# Altium project MQP_DC_AC_Inverter.PrjPcb (part 3 of 4)
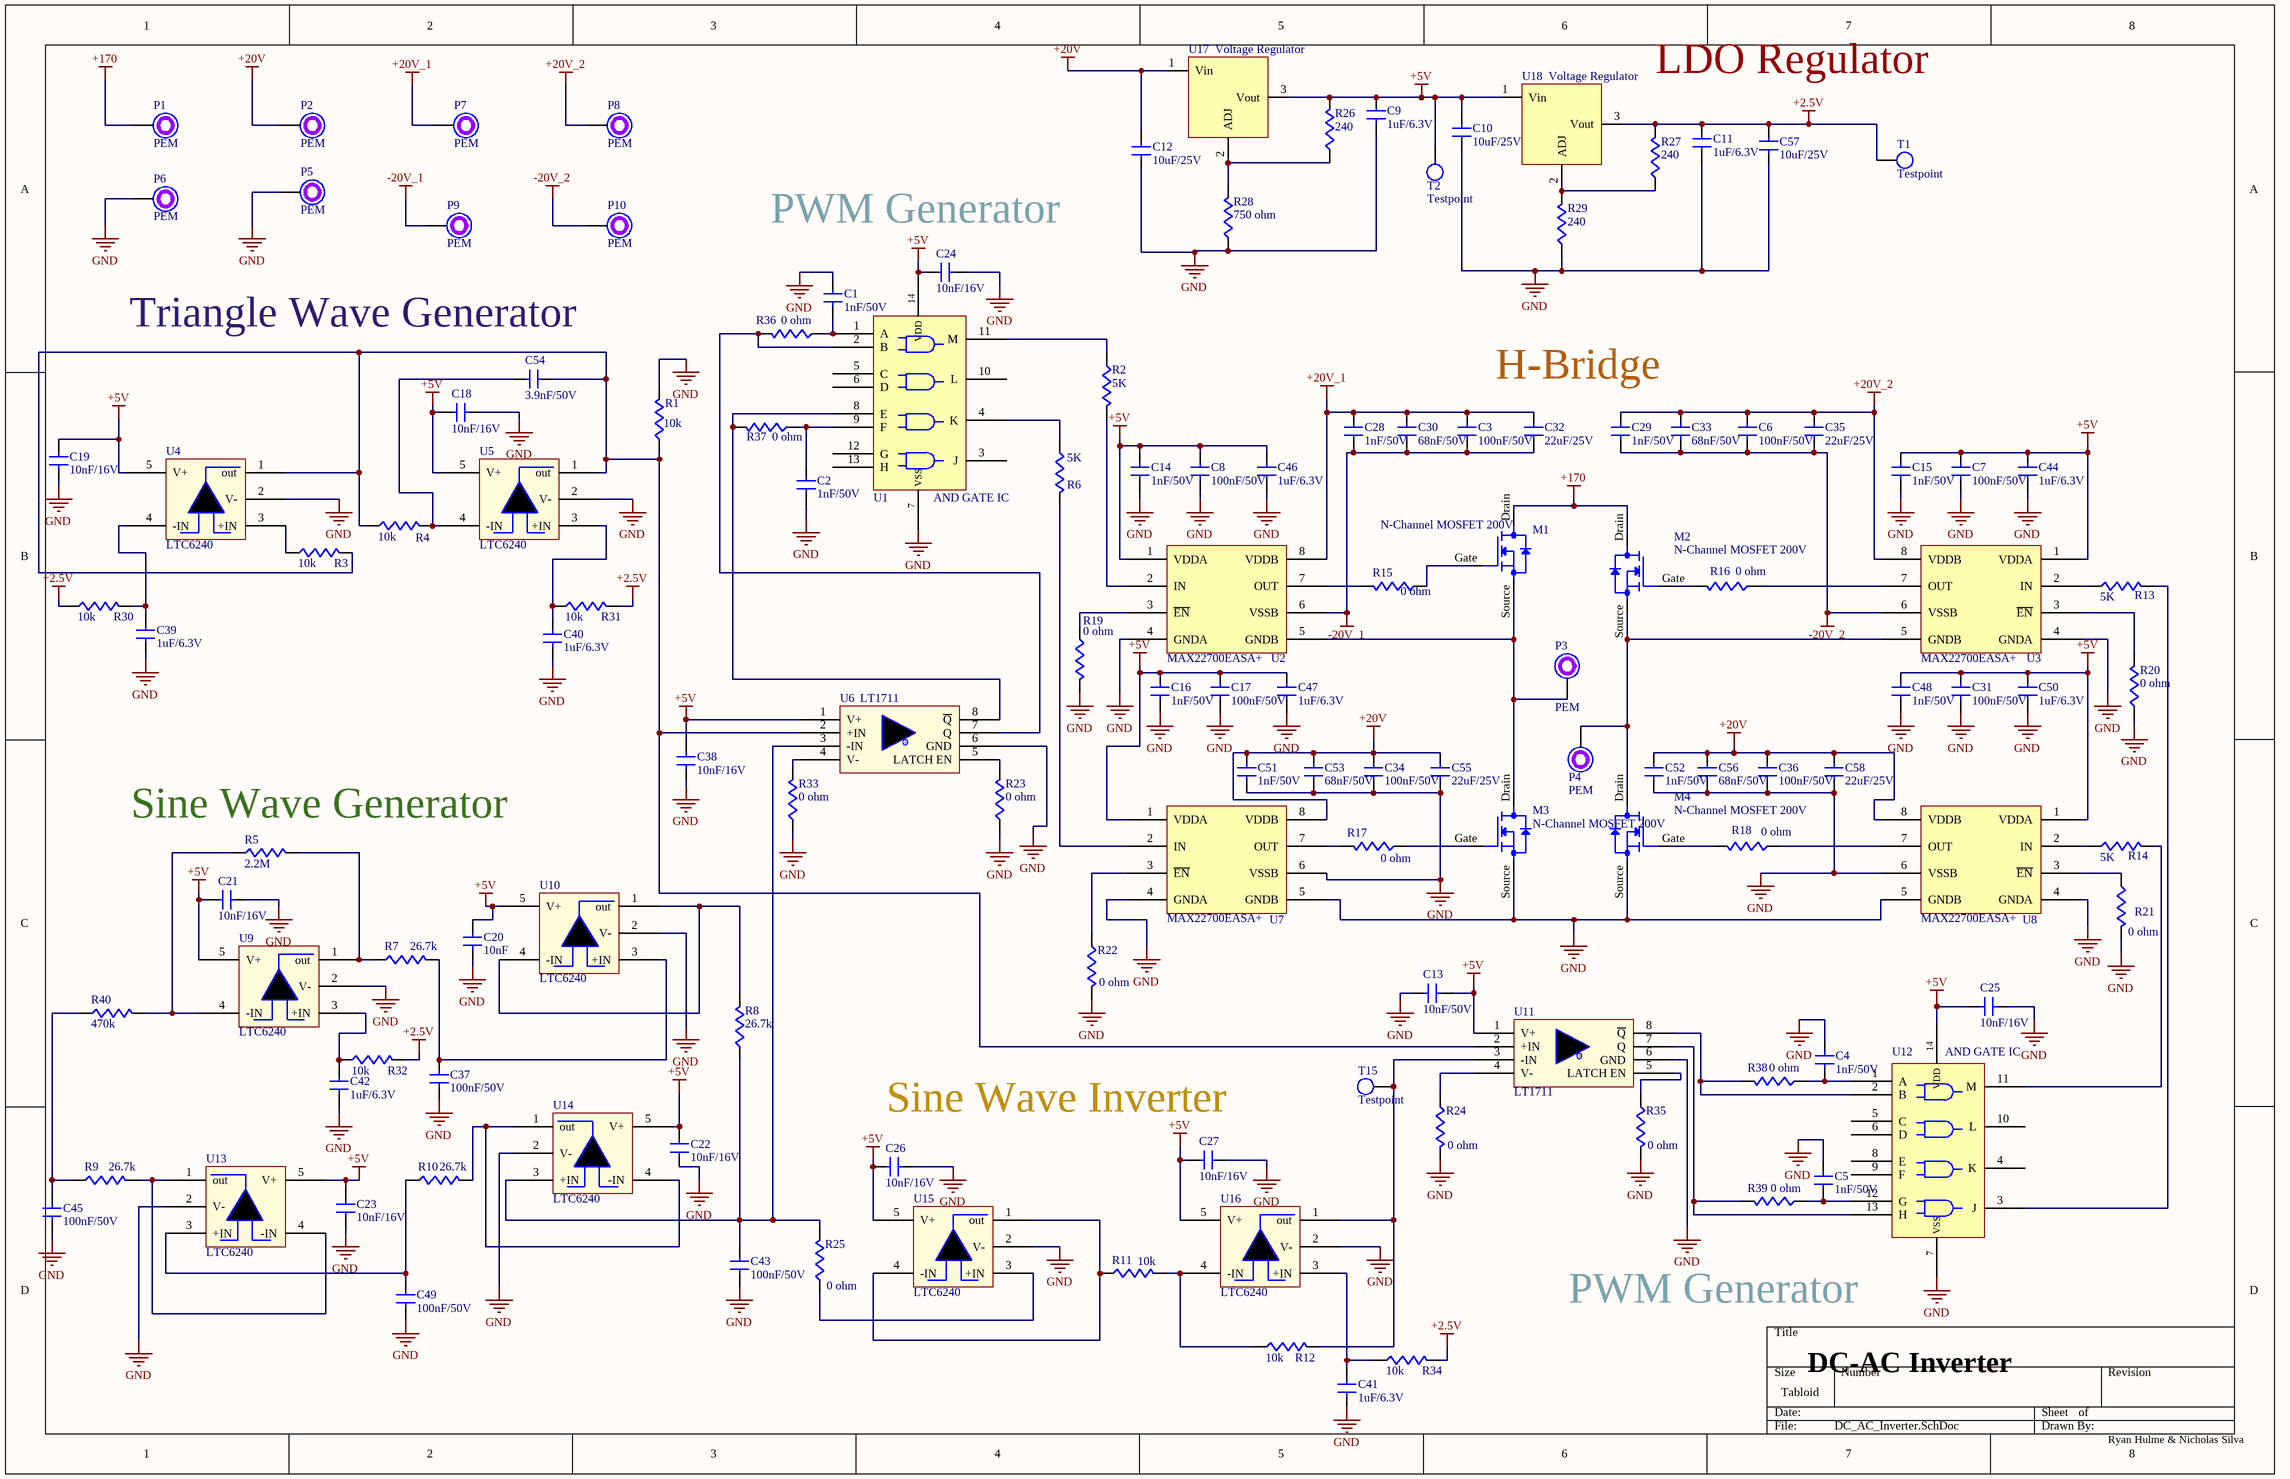
[diagram p2: DC_AC_Inverter.SchDoc]

## Sheet DC_AC_Inverter.SchDoc (continued)

### Library data of the parts (continued)
C30 C33 C53 C56 = C0603C683K5RACTU: Ceramic Capacitor, Multilayer, Ceramic, 50V, 10% +Tol, 10% -Tol, X7R, 15% TC, 0.068uF, Surface Mount, 0603; Manufacturer: KEMET; Value: 68nF; Dissipation Factor: 2.5%; Temperature Coefficient: 30ppm/°C; Supplier: DigiKey; Supplier Part Number: 399-C0603C683K5RACTUCT-ND; Manufacturer Part Number: C0603C683K5RACTU; RoHS: Compliant; Category: Ceramic Capacitors; Stock: 75691; Pricing: 1=0.1, 10=0.054, 50=0.0374, 100=0.0323, 500=0.0237, 1000=0.02004 (USD); Case/Package: 0603; Case Code (Imperial): 0603; Case Code (Metric): 1608; China RoHS: Compliant; Country of Origin: Mexico; Depth: 800µm; Dielectric: X7R; Dielectric Material: Ceramic; Export Control Classification Number (ECCN) Code: EAR99; Height: 800µm; Harmonized Tariff Schedule (HTS) Code: 8532.24.00.20; Introduction Date: 2008-01-10; Lead Pitch: 700µm; Length: 1.6mm; Lifecycle Status: Production; Material: Ceramic; Max Operating Temperature: 125°C; Min Operating Temperature: -55°C; Mounting Technology: Surface Mount; Pins: 2; Number of Terminals: 2; Packaging: Cut Tape; Radiation Hardening: No; REACH SVHC: Yes; Schedule B: 8532240020, 8532240020|8532240020, 8532240020|8532240020|8532240020, 8532240020|8532240020|8532240020|8532240020; Termination: SMD/SMT; Thickness: 863.6µm; Tolerance: 10%; Voltage: 50V; Voltage Rating: 50V; Voltage Rating (AC): 50V; Voltage Rating (DC): 50V; Width: 800µm; ComponentLink1URL: https://datasheet.octopart.com:443/C0603C683K5RACTU-KEMET-datasheet-178445679.pdf?src-supplier=IHS; ComponentLink1Description: https://datasheet.octopart.com:443/C0603C683K5RACTU-KEMET-datasheet-178445679.pdf?src-supplier=IHS; ComponentLink2URL: https://datasheet.octopart.com:443/C0603C683K5RAC7867-KEMET-datasheet-184792974.pdf?src-supplier=IHS; ComponentLink2Description: https://datasheet.octopart.com:443/C0603C683K5RAC7867-KEMET-datasheet-184792974.pdf?src-supplier=IHS; ComponentLink3URL: https://datasheet.octopart.com:443/C0603C683K5RACTU-KEMET-datasheet-137357759.pdf?src-supplier=Farnell; ComponentLink3Description: https://datasheet.octopart.com:443/C0603C683K5RACTU-KEMET-datasheet-137357759.pdf?src-supplier=Farnell; ComponentLink4URL: https://datasheet.octopart.com:443/C0603C683K5RACTU-KEMET-datasheet-101575963.pdf?src-supplier=Farnell; ComponentLink4Description: https://datasheet.octopart.com:443/C0603C683K5RACTU-KEMET-datasheet-101575963.pdf?src-supplier=Farnell; ComponentLink5URL: https://datasheet.octopart.com:443/C0603C683K5RACTU-KEMET-datasheet-176142257.pdf?src-supplier=Farnell; ComponentLink5Description: https://datasheet.octopart.com:443/C0603C683K5RACTU-KEMET-datasheet-176142257.pdf?src-supplier=Farnell; ComponentLink6URL: https://datasheet.octopart.com:443/C0603C683K5RACTU-Kemet-datasheet-500041.pdf?src-supplier=Farnell; ComponentLink6Description: https://datasheet.octopart.com:443/C0603C683K5RACTU-Kemet-datasheet-500041.pdf?src-supplier=Farnell; ComponentLink7URL: https://datasheet.octopart.com:443/C0603C683K5RACTU-KEMET-datasheet-137357764.pdf?src-supplier=Upverter; ComponentLink7Description: https://datasheet.octopart.com:443/C0603C683K5RACTU-KEMET-datasheet-137357764.pdf?src-supplier=Upverter; ComponentLink8URL: https://datasheet.octopart.com:443/C0603C683K5RACTU-KEMET-datasheet-157246124.pdf?src-supplier=Electro+Sonic; ComponentLink8Description: https://datasheet.octopart.com:443/C0603C683K5RACTU-KEMET-datasheet-157246124.pdf?src-supplier=Electro+Sonic; ComponentLink9URL: https://datasheet.octopart.com:443/C0603C683K5RACTU-KEMET-datasheet-32036385.pdf?src-supplier=Electro+Sonic; ComponentLink9Description: https://datasheet.octopart.com:443/C0603C683K5RACTU-KEMET-datasheet-32036385.pdf?src-supplier=Electro+Sonic; ComponentLink10URL: https://datasheet.octopart.com:443/C0603C683K5RACTU-KEMET-datasheet-178088105.pdf?src-supplier=Newark; ComponentLink10Description: https://datasheet.octopart.com:443/C0603C683K5RACTU-KEMET-datasheet-178088105.pdf?src-supplier=Newark; ComponentLink11URL: https://datasheet.octopart.com:443/C0603C683K5RACTU-KEMET-datasheet-130256537.pdf?src-supplier=Newark; ComponentLink11Description: https://datasheet.octopart.com:443/C0603C683K5RACTU-KEMET-datasheet-130256537.pdf?src-supplier=Newark; ComponentLink12URL: https://datasheet.octopart.com:443/C0603C683K5RACTU-Kemet-datasheet-27203261.pdf?src-supplier=Newark; ComponentLink12Description: https://datasheet.octopart.com:443/C0603C683K5RACTU-Kemet-datasheet-27203261.pdf?src-supplier=Newark; ComponentLink13URL: https://datasheet.octopart.com:443/C0603C683K5RACTU-Kemet-datasheet-12608295.pdf?src-supplier=Newark; ComponentLink13Description: https://datasheet.octopart.com:443/C0603C683K5RACTU-Kemet-datasheet-12608295.pdf?src-supplier=Newark; ComponentLink14URL: https://datasheet.octopart.com:443/C0603C683K5RACTU-Kemet-datasheet-11992184.pdf?src-supplier=Newark; ComponentLink14Description: https://datasheet.octopart.com:443/C0603C683K5RACTU-Kemet-datasheet-11992184.pdf?src-supplier=Newark; ComponentLink15URL: https://datasheet.octopart.com:443/C0603C683K5RACTU-Kemet-datasheet-10942409.pdf?src-supplier=Newark; ComponentLink15Description: https://datasheet.octopart.com:443/C0603C683K5RACTU-Kemet-datasheet-10942409.pdf?src-supplier=Newark; ComponentLink16URL: https://datasheet.octopart.com:443/C0603C683K5RACTU-Kemet-datasheet-10404442.pdf?src-supplier=Newark; ComponentLink16Description: https://datasheet.octopart.com:443/C0603C683K5RACTU-Kemet-datasheet-10404442.pdf?src-supplier=Newark; ComponentLink17URL: https://datasheet.octopart.com:443/C0603C683K5RACTU-KEMET-datasheet-164512540.pdf?src-supplier=TME; ComponentLink17Description: https://datasheet.octopart.com:443/C0603C683K5RACTU-KEMET-datasheet-164512540.pdf?src-supplier=TME; ComponentLink18URL: https://datasheet.octopart.com:443/C0603C683K5RACTU-KEMET-datasheet-68304558.pdf?src-supplier=TME; ComponentLink18Description: https://datasheet.octopart.com:443/C0603C683K5RACTU-KEMET-datasheet-68304558.pdf?src-supplier=TME; ComponentLink19URL: https://datasheet.octopart.com:443/C0603C683K5RACTU-KEMET-datasheet-68331906.pdf?src-supplier=TME; ComponentLink19Description: https://datasheet.octopart.com:443/C0603C683K5RACTU-KEMET-datasheet-68331906.pdf?src-supplier=TME; ComponentLink20URL: https://datasheet.octopart.com:443/C0603C683K5RACTU-KEMET-datasheet-110724412.pdf?src-supplier=RS+(Formerly+Allied+Electronics); ComponentLink20Description: https://datasheet.octopart.com:443/C0603C683K5RACTU-KEMET-datasheet-110724412.pdf?src-supplier=RS+(Formerly+Allied+Electronics); ComponentLink21URL: https://datasheet.octopart.com:443/C0603C683K5RACTU-Kemet-datasheet-60243841.pdf?src-supplier=RS+(Formerly+Allied+Electronics); ComponentLink21Description: https://datasheet.octopart.com:443/C0603C683K5RACTU-Kemet-datasheet-60243841.pdf?src-supplier=RS+(Formerly+Allied+Electronics); ComponentLink22URL: https://datasheet.octopart.com/C0603C683K5RACTU-KEMET-datasheet-84169754.pdf; ComponentLink22Description: https://datasheet.octopart.com/C0603C683K5RACTU-KEMET-datasheet-84169754.pdf; ComponentLink23URL: https://datasheet.octopart.com:443/C0603C683K5RACTU-Kemet-datasheet-24570007.pdf?src-supplier=element14+APAC; ComponentLink23Description: https://datasheet.octopart.com:443/C0603C683K5RACTU-Kemet-datasheet-24570007.pdf?src-supplier=element14+APAC; ComponentLink24URL: https://datasheet.octopart.com:443/C0603C683K5RACTU-Kemet-datasheet-22084244.pdf?src-supplier=element14+APAC; ComponentLink24Description: https://datasheet.octopart.com:443/C0603C683K5RACTU-Kemet-datasheet-22084244.pdf?src-supplier=element14+APAC; ComponentLink25URL: https://datasheet.octopart.com:443/C0603C683K5RACTU-Kemet-datasheet-11790453.pdf?src-supplier=Arrow+Electronics; ComponentLink25Description: https://datasheet.octopart.com:443/C0603C683K5RACTU-Kemet-datasheet-11790453.pdf?src-supplier=Arrow+Electronics; ComponentLink26URL: https://datasheet.octopart.com:443/C0603C683K5RAC7867-KEMET-datasheet-164857143.pdf?src-supplier=Burklin+Elektronik; ComponentLink26Description: https://datasheet.octopart.com:443/C0603C683K5RAC7867-KEMET-datasheet-164857143.pdf?src-supplier=Burklin+Elektronik
C32 C35 C55 C58 = GRM188C61E226ME01J: Ceramic Capacitor, Multilayer, Ceramic, 25V, 20% +Tol, 20% -Tol, X5S, 22% TC, 22uF, Surface Mount, 0603; Manufacturer: Murata; Value: 22µF; Supplier: DigiKey; Supplier Part Number: 490-GRM188C61E226ME01JDKR-ND; Manufacturer Part Number: GRM188C61E226ME01J; RoHS: Compliant; Category: Ceramic Capacitors; Stock: 20437; Pricing: 1=0.41, 10=0.244, 50=0.181, 100=0.1615, 500=0.12866, 1000=0.11854, 2500=0.10786, 5000=0.10143 (USD); Case/Package: 0603; Dielectric: X5S; Dielectric Material: Ceramic; Export Control Classification Number (ECCN) Code: EAR99; Height: 800µm; Harmonized Tariff Schedule (HTS) Code: 8532.24.00.20; Introduction Date: 2024-04-22; Length: 1.6mm; Lifecycle Status: Production; Material: Ceramic; Max Operating Temperature: 85°C; Min Operating Temperature: -55°C; Mounting Technology: Surface Mount; Number of Terminals: 2; REACH SVHC: Yes; Thickness: 800µm; Tolerance: 20%; Voltage Rating: 25V; Voltage Rating (DC): 25V; Width: 800µm; ComponentLink1URL: https://datasheet.octopart.com/GRM188C61E226ME01J-Murata-datasheet-12515295.pdf; ComponentLink1Description: https://datasheet.octopart.com/GRM188C61E226ME01J-Murata-datasheet-12515295.pdf; ComponentLink2URL: https://datasheet.octopart.com/GRM188C61E226ME01J-Murata-datasheet-12510076.pdf; ComponentLink2Description: https://datasheet.octopart.com/GRM188C61E226ME01J-Murata-datasheet-12510076.pdf; ComponentLink3URL: https://datasheet.octopart.com/GRM188C61E226ME01J-Murata-datasheet-11978611.pdf; ComponentLink3Description: https://datasheet.octopart.com/GRM188C61E226ME01J-Murata-datasheet-11978611.pdf; ComponentLink4URL: https://datasheet.octopart.com/GRM188C61E226ME01J-Murata-datasheet-10025737.pdf; ComponentLink4Description: https://datasheet.octopart.com/GRM188C61E226ME01J-Murata-datasheet-10025737.pdf; ComponentLink5URL: https://datasheet.octopart.com/GRM188C61E226ME01J-Murata-datasheet-8819587.pdf; ComponentLink5Description: https://datasheet.octopart.com/GRM188C61E226ME01J-Murata-datasheet-8819587.pdf; ComponentLink6URL: http://sigma.octopart.com:80/reach_statement/Murata-company-16.pdf?src-supplier=Compliance+Statements; ComponentLink6Description: http://sigma.octopart.com:80/reach_statement/Murata-company-16.pdf?src-supplier=Compliance+Statements
C54 = GCM1885C1H392JA16D: 0603 3.9 nF 50 V ±5 % Tolerance C0G SMT Multilayer Ceramic Capacitor; Manufacturer: Murata; Manufacturer Lifecycle Status: IN PRODUCTION; Value: 3.9nF; Temperature Coefficient: 30ppm/°C; Tolerance: 5%; Voltage Rating: 50V; Supplier: DigiKey; Supplier Part Number: 490-11958-1-ND; Manufacturer Part Number: GCM1885C1H392JA16D; RoHS: Compliant; Category: Ceramic Capacitors; Stock: 87384; Pricing: 1=0.1, 10=0.046, 50=0.0314, 100=0.027, 500=0.01964, 1000=0.01737 (USD); Case/Package: 0603; Case Code (Imperial): 0603; Case Code (Metric): 1608; Depth: 800µm; Dielectric: C0G; Dielectric Material: Ceramic; Export Control Classification Number (ECCN) Code: EAR99; Height: 800µm; Harmonized Tariff Schedule (HTS) Code: 8532.24.00.20; Introduction Date: 2010-10-29; Lead Free: Lead Free; Length: 1.6mm; Lifecycle Status: Production; Material: Ceramic; Max Operating Temperature: 125°C; Min Operating Temperature: -55°C; Mounting Technology: Surface Mount; Number of Terminals: 2; Packaging: Tape and Reel; Ratings: AEC-Q200; REACH SVHC: Yes; Schedule B: 8532240020, 8532240020|8532240020, 8532240020|8532240020|8532240020, 8532240020|8532240020|8532240020|8532240020; Termination: SMD/SMT; Voltage Rating (DC): 50V; Weight: 6.293594mg; Width: 800µm; ComponentLink1URL: https://datasheet.octopart.com:443/GCM1885C1H392JA16D-Murata-datasheet-149522577.pdf?src-supplier=Newark; ComponentLink1Description: https://datasheet.octopart.com:443/GCM1885C1H392JA16D-Murata-datasheet-149522577.pdf?src-supplier=Newark; ComponentLink2URL: https://datasheet.octopart.com:443/GCM1885C1H392JA16D-Murata-datasheet-141266224.pdf?src-supplier=Ciiva; ComponentLink2Description: https://datasheet.octopart.com:443/GCM1885C1H392JA16D-Murata-datasheet-141266224.pdf?src-supplier=Ciiva; ComponentLink3URL: https://datasheet.octopart.com:443/GCM1885C1H392JA16D-Murata-datasheet-140657019.pdf?src-supplier=Ciiva; ComponentLink3Description: https://datasheet.octopart.com:443/GCM1885C1H392JA16D-Murata-datasheet-140657019.pdf?src-supplier=Ciiva; ComponentLink4URL: https://datasheet.octopart.com:443/GCM1885C1H392JA16D-Murata-datasheet-138716719.pdf?src-supplier=Ciiva; ComponentLink4Description: https://datasheet.octopart.com:443/GCM1885C1H392JA16D-Murata-datasheet-138716719.pdf?src-supplier=Ciiva; ComponentLink5URL: https://datasheet.octopart.com:443/GCM1885C1H392JA16D-Murata-datasheet-142295892.pdf?src-supplier=Arrow.cn; ComponentLink5Description: https://datasheet.octopart.com:443/GCM1885C1H392JA16D-Murata-datasheet-142295892.pdf?src-supplier=Arrow.cn; ComponentLink6URL: https://datasheet.octopart.com:443/GCM1885C1H392JA16D-Murata-datasheet-12532847.pdf?src-supplier=Future+Electronics; ComponentLink6Description: https://datasheet.octopart.com:443/GCM1885C1H392JA16D-Murata-datasheet-12532847.pdf?src-supplier=Future+Electronics; ComponentLink7URL: https://datasheet.octopart.com:443/GCM1885C1H392JA16D-Murata-datasheet-44781017.pdf?src-supplier=Future+Electronics; ComponentLink7Description: https://datasheet.octopart.com:443/GCM1885C1H392JA16D-Murata-datasheet-44781017.pdf?src-supplier=Future+Electronics; ComponentLink8URL: https://datasheet.octopart.com:443/GCM1885C1H392JA16D-Murata-datasheet-12511495.pdf?src-supplier=TME; ComponentLink8Description: https://datasheet.octopart.com:443/GCM1885C1H392JA16D-Murata-datasheet-12511495.pdf?src-supplier=TME; ComponentLink9URL: http://sigma.octopart.com:80/reach_statement/Murata-company-16.pdf?src-supplier=Compliance+Statements; ComponentLink9Description: http://sigma.octopart.com:80/reach_statement/Murata-company-16.pdf?src-supplier=Compliance+Statements
M1-M4 = IPB068N20NM6ATMA1: Trans MOSFET N-CH 200V 15.4A 3-Pin(2+Tab) D2PAK T/R; Manufacturer: Infineon; Supplier: DigiKey; Supplier Part Number: 448-IPB068N20NM6ATMA1CT-ND; Manufacturer Part Number: IPB068N20NM6ATMA1; RoHS: Compliant; Category: MOSFETs; Stock: 4020; Pricing: 1=8.02, 10=5.45, 100=4.2066 (USD); Lifecycle Status: Production; REACH SVHC: Yes; ComponentLink1URL: https://datasheet.octopart.com:443/IPB068N20NM6ATMA1-Infineon-datasheet-188885164.pdf?src-supplier=TME; ComponentLink1Description: https://datasheet.octopart.com:443/IPB068N20NM6ATMA1-Infineon-datasheet-188885164.pdf?src-supplier=TME; ComponentLink2URL: http://sigma.octopart.com:80/conflict_mineral_statement/Infineon-company-51.pdf?src-supplier=Compliance+Statements; ComponentLink2Description: http://sigma.octopart.com:80/conflict_mineral_statement/Infineon-company-51.pdf?src-supplier=Compliance+Statements
P1-P10 = PEMs: PEM: / SMTSOB-632-4ET
R1 R3 R4 R11 R12 R30-R32 R34 = Y116910K0000T9R: Res Metal Foil 2917 10K Ohm 0.01% 3/5W 2ppm/C Molded SMD T/R - Custom Tape W/Lea; Manufacturer: VPG Foil Resistors; Power Dissipation: 300mW; Power Rating: 600mW; Value: 10kΩ; Rise Time: 1ns; Temperature Coefficient: 2ppm/°C; Voltage Rating: 300V; Working Voltage: 180V; Supplier: DigiKey; Supplier Part Number: Y1169-10KCT-ND; Manufacturer Part Number: Y116910K0000T9R; RoHS: Compliant; Category: Chip SMD Resistors; Stock: 296; Pricing: 1=30.94, 10=22.172, 25=19.8044, 50=18.3232 (USD); Case/Package: Molded; China RoHS: Compliant; Composition: Metal Foil; Depth: 4.32mm; Height: 2.79mm; Length: 7.29mm; Lifecycle Status: Production; Max Operating Temperature: 175°C; Military Standard: MIL-PRF-55182; Min Operating Temperature: -55°C; Mounting Technology: Surface Mount; Number of Terminals: 2; REACH SVHC: Yes; Termination: J-Lead; Tolerance: 0.01%; Voltage Rating (AC): 300V; Voltage Rating (DC): 300V; Width: 4.32mm; ComponentLink1URL: https://datasheet.octopart.com:443/Y116910K0000T9R-VPG-Foil-Resistors-datasheet-41195406.pdf?src-supplier=IHS; ComponentLink1Description: https://datasheet.octopart.com:443/Y116910K0000T9R-VPG-Foil-Resistors-datasheet-41195406.pdf?src-supplier=IHS; ComponentLink2URL: https://datasheet.octopart.com:443/Y116910K0000T9R-VPG-Foil-Resistors-datasheet-182187878.pdf?src-supplier=IHS; ComponentLink2Description: https://datasheet.octopart.com:443/Y116910K0000T9R-VPG-Foil-Resistors-datasheet-182187878.pdf?src-supplier=IHS; ComponentLink3URL: https://datasheet.octopart.com:443/Y116910K0000T9R-VPG-Foil-Resistors-datasheet-12518376.pdf?src-supplier=Factory+Futures; ComponentLink3Description: https://datasheet.octopart.com:443/Y116910K0000T9R-VPG-Foil-Resistors-datasheet-12518376.pdf?src-supplier=Factory+Futures
R2 R6 R13 R14 = PNM0805E5001BST5: Res Thin Film 0805 5K Ohm 0.1% 0.2W(1/5W) ±25ppm/C Sulfur Resistant Pad SMD Medical T/R; Manufacturer: Vishay; Power Dissipation: 200mW; Value: 5kΩ; Temperature Coefficient: 25ppm/°C; Voltage Rating: 100V; Supplier: DigiKey; Supplier Part Number: PNM0805-5.0KBCT-ND; Manufacturer Part Number: PNM0805E5001BST5; RoHS: Compliant; Category: Chip SMD Resistors; Stock: 3988; Pricing: 1=0.78, 10=0.647, 25=0.5996, 50=0.5668, 100=0.5274, 250=0.50048 (USD); Case/Package: 0805; Case Code (Imperial): 0805; Case Code (Metric): 2012; Composition: Thin Film; Height: 381µm; Length: 2.032mm; Lifecycle Status: Production; Max Operating Temperature: 150°C; Min Operating Temperature: -55°C; Mounting Technology: Surface Mount; Pins: 2; Number of Terminals: 2; Packaging: Cut Tape; Power Rating: 200mW; Radiation Hardening: No; REACH SVHC: Yes; Schedule B: 8533210045, 8533210045|8533210045|8533210045|8533210045|8533210045; Tolerance: 0.1%; Voltage Rating (DC): 100V; Width: 1.27mm; Working Voltage: 100V; ComponentLink1URL: https://datasheet.octopart.com:443/PNM0805E5001BST5-Vishay-datasheet-170667721.pdf?src-supplier=IHS; ComponentLink1Description: https://datasheet.octopart.com:443/PNM0805E5001BST5-Vishay-datasheet-170667721.pdf?src-supplier=IHS; ComponentLink2URL: https://datasheet.octopart.com:443/PNM0805E5001BST5-Vishay-datasheet-12549948.pdf?src-supplier=Factory+Futures; ComponentLink2Description: https://datasheet.octopart.com:443/PNM0805E5001BST5-Vishay-datasheet-12549948.pdf?src-supplier=Factory+Futures; ComponentLink3URL: https://datasheet.octopart.com:443/PNM0805E5001BST5-Vishay-datasheet-12534889.pdf?src-supplier=Factory+Futures; ComponentLink3Description: https://datasheet.octopart.com:443/PNM0805E5001BST5-Vishay-datasheet-12534889.pdf?src-supplier=Factory+Futures; ComponentLink4URL: https://datasheet.octopart.com:443/PNM0805E5001BST5-Vishay-datasheet-12521829.pdf?src-supplier=Factory+Futures; ComponentLink4Description: https://datasheet.octopart.com:443/PNM0805E5001BST5-Vishay-datasheet-12521829.pdf?src-supplier=Factory+Futures; ComponentLink5URL: https://datasheet.octopart.com:443/PNM0805E5001BST5-Vishay-datasheet-12520543.pdf?src-supplier=Factory+Futures; ComponentLink5Description: https://datasheet.octopart.com:443/PNM0805E5001BST5-Vishay-datasheet-12520543.pdf?src-supplier=Factory+Futures; ComponentLink6URL: https://datasheet.octopart.com:443/PNM0805E5001BST5-Vishay-datasheet-62321198.pdf?src-supplier=Farnell; ComponentLink6Description: https://datasheet.octopart.com:443/PNM0805E5001BST5-Vishay-datasheet-62321198.pdf?src-supplier=Farnell; ComponentLink7URL: https://datasheet.octopart.com:443/PNM0805E5001BST5-Vishay-datasheet-10025851.pdf?src-supplier=Newark; ComponentLink7Description: https://datasheet.octopart.com:443/PNM0805E5001BST5-Vishay-datasheet-10025851.pdf?src-supplier=Newark; ComponentLink8URL: http://sigma.octopart.com:80/rohs_statement/Vishay-company-15.pdf?src-supplier=Compliance+Statements; ComponentLink8Description: http://sigma.octopart.com:80/rohs_statement/Vishay-company-15.pdf?src-supplier=Compliance+Statements
R5 = RC0402FR-072M2L: 62.5mW Thick Film Resistors 50V ±100ppm/℃ ±1% 2.2MΩ 0402 Chip Resistor - Surface Mount ROHS; Manufacturer: Yageo Group; Max Power Dissipation: 63mW; Temperature Coefficient: 100ppm/°C; Supplier: DigiKey; Supplier Part Number: 13-RC0402FR-072M2LCT-ND; Manufacturer Part Number: RC0402FR-072M2L; RoHS: Compliant; Category: Chip SMD Resistors; Stock: 257023; Pricing: 1=0.1, 10=0.005, 25=0.0044, 50=0.0032 (USD); Case/Package: 0402; Case Code (Imperial): 0402; Case Code (Metric): 1005; China RoHS: Non-Compliant; Composition: Thick Film; Depth: 500µm; Features: Moisture Resistant; Height: 350µm; Lead Free: Lead Free; Length: 1mm; Lifecycle Status: Production; Max Operating Temperature: 155°C; Military Standard: Not; Min Operating Temperature: -55°C; Mounting Technology: Surface Mount; Pins: 2; Number of Terminals: 2; Number of Terminations: 2; Packaging: Cut Tape; Power Dissipation: 62.5mW; Power Rating: 63mW; REACH SVHC: Yes; Value: 2.2MΩ; Schedule B: 8533210045, 8533210045|8533210045, 8533210045|8533210045|8533210045, 8533210045|8533210045|8533210045|8533210045|8533210045|8533210045|8533210045|8533210045|8533210045|8533210045|8533210045|8533210045|8533210045|8533210045|8533210045|8533210045|8533210045|8533210045|8533210045|8533210045|8533210045|8533210045|8533210045|85; Termination: SMD/SMT; Tolerance: 1%; Voltage Rating: 50V; Voltage Rating (AC): 50V; Voltage Rating (DC): 50V; Width: 500µm; Working Voltage: 50V; ComponentLink1URL: https://datasheet.octopart.com:443/RC0402FR-072M2L-Yageo-datasheet-175887523.pdf?src-supplier=Newark; ComponentLink1Description: https://datasheet.octopart.com:443/RC0402FR-072M2L-Yageo-datasheet-175887523.pdf?src-supplier=Newark; ComponentLink2URL: https://datasheet.octopart.com:443/RC0402FR-072M2L-Yageo-datasheet-8324527.pdf?src-supplier=Newark; ComponentLink2Description: https://datasheet.octopart.com:443/RC0402FR-072M2L-Yageo-datasheet-8324527.pdf?src-supplier=Newark; ComponentLink3URL: https://datasheet.octopart.com:443/RC0402FR-072M2L-Yageo-datasheet-103092701.pdf?src-supplier=Upverter; ComponentLink3Description: https://datasheet.octopart.com:443/RC0402FR-072M2L-Yageo-datasheet-103092701.pdf?src-supplier=Upverter; ComponentLink4URL: https://datasheet.octopart.com:443/RC0402FR-072M2L-Yageo-Group-datasheet-190305687.pdf?src-supplier=Future+Electronics; ComponentLink4Description: https://datasheet.octopart.com:443/RC0402FR-072M2L-Yageo-Group-datasheet-190305687.pdf?src-supplier=Future+Electronics; ComponentLink5URL: https://datasheet.octopart.com:443/RC0402FR-072M2L-Yageo-datasheet-164759695.pdf?src-supplier=Future+Electronics; ComponentLink5Description: https://datasheet.octopart.com:443/RC0402FR-072M2L-Yageo-datasheet-164759695.pdf?src-supplier=Future+Electronics; ComponentLink6URL: https://datasheet.octopart.com:443/RC0402FR-072M2L-Yageo-datasheet-137700087.pdf?src-supplier=Future+Electronics; ComponentLink6Description: https://datasheet.octopart.com:443/RC0402FR-072M2L-Yageo-datasheet-137700087.pdf?src-supplier=Future+Electronics; ComponentLink7URL: https://datasheet.octopart.com:443/RC0402FR-072M2L-Yageo-datasheet-12531192.pdf?src-supplier=Future+Electronics; ComponentLink7Description: https://datasheet.octopart.com:443/RC0402FR-072M2L-Yageo-datasheet-12531192.pdf?src-supplier=Future+Electronics; ComponentLink8URL: https://datasheet.octopart.com:443/RC0402FR-072M2L-Yageo-datasheet-10408619.pdf?src-supplier=element14+APAC; ComponentLink8Description: https://datasheet.octopart.com:443/RC0402FR-072M2L-Yageo-datasheet-10408619.pdf?src-supplier=element14+APAC; ComponentLink9URL: https://datasheet.octopart.com:443/RC0402FR-072M2L-Yageo-datasheet-62067350.pdf?src-supplier=element14+APAC; ComponentLink9Description: https://datasheet.octopart.com:443/RC0402FR-072M2L-Yageo-datasheet-62067350.pdf?src-supplier=element14+APAC; ComponentLink10URL: https://datasheet.octopart.com:443/RC0402FR-072M2L-Yageo-datasheet-148775077.pdf?src-supplier=JRH+Electronics; ComponentLink10Description: https://datasheet.octopart.com:443/RC0402FR-072M2L-Yageo-datasheet-148775077.pdf?src-supplier=JRH+Electronics; ComponentLink11URL: https://datasheet.octopart.com/RC0402FR-072M2L-Yageo-datasheet-73766026.pdf; ComponentLink11Description: https://datasheet.octopart.com/RC0402FR-072M2L-Yageo-datasheet-73766026.pdf; ComponentLink12URL: http://sigma.octopart.com:80/conflict_mineral_statement/Yageo-company-3.pdf?src-supplier=Compliance+Statements; ComponentLink12Description: http://sigma.octopart.com:80/conflict_mineral_statement/Yageo-company-3.pdf?src-supplier=Compliance+Statements; ComponentLink13URL: http://sigma.octopart.com:80/rohs_statement/Yageo-company-2.pdf?src-supplier=Compliance+Statements; ComponentLink13Description: http://sigma.octopart.com:80/rohs_statement/Yageo-company-2.pdf?src-supplier=Compliance+Statements
R7-R10 = RC0402FR-0726K7L: Res Thick Film 0402 26.7K Ohm 1% 1/16W ±100ppm/°C Molded SMD Paper T/R; Manufacturer: Yageo Group; Max Power Dissipation: 63mW; Power Dissipation: 62.5mW; Value: 26.7kΩ; Voltage Rating: 50V; Supplier: Avnet; Supplier Part Number: 49AK1374; Manufacturer Part Number: RC0402FR-0726K7L; RoHS: Compliant; Category: Chip SMD Resistors; Stock: 5473; Pricing: 1=0.1, 25=0.009, 100=0.006, 500=0.005, 2500=0.004 (USD); Case/Package: 0402; Case Code (Imperial): 0402; Case Code (Metric): 1005; China RoHS: Non-Compliant; Composition: Thick Film; Contact Plating: Tin; Depth: 500µm; Features: Moisture Resistant; Height: 350µm; Lead Free: Lead Free; Length: 1mm; Lifecycle Status: Production; Max Operating Temperature: 155°C; Military Standard: Not; Min Operating Temperature: -55°C; Mounting Technology: Surface Mount; Number of Terminals: 2; Number of Terminations: 2; Power Rating: 63mW; REACH SVHC: Yes; Schedule B: 8533210045, 8533210045|8533210045, 8533210045|8533210045|8533210045, 8533210045|8533210045|8533210045|8533210045; Temperature Coefficient: 100ppm/°C; Termination: SMD/SMT; Tolerance: 1%; Voltage Rating (DC): 50V; Width: 500µm; Working Voltage: 50V; ComponentLink1URL: https://datasheet.octopart.com:443/RC0402FR-0726K7L-Yageo-datasheet-175887523.pdf?src-supplier=Newark; ComponentLink1Description: https://datasheet.octopart.com:443/RC0402FR-0726K7L-Yageo-datasheet-175887523.pdf?src-supplier=Newark; ComponentLink2URL: https://datasheet.octopart.com:443/RC0402FR-0726K7L-Yageo-datasheet-103092701.pdf?src-supplier=Upverter; ComponentLink2Description: https://datasheet.octopart.com:443/RC0402FR-0726K7L-Yageo-datasheet-103092701.pdf?src-supplier=Upverter; ComponentLink3URL: https://datasheet.octopart.com:443/RC0402FR-0726K7L-Yageo-Group-datasheet-189192902.pdf?src-supplier=TME; ComponentLink3Description: https://datasheet.octopart.com:443/RC0402FR-0726K7L-Yageo-Group-datasheet-189192902.pdf?src-supplier=TME; ComponentLink4URL: https://datasheet.octopart.com:443/RC0402FR-0726K7L-Yageo-Group-datasheet-176638170.pdf?src-supplier=TME; ComponentLink4Description: https://datasheet.octopart.com:443/RC0402FR-0726K7L-Yageo-Group-datasheet-176638170.pdf?src-supplier=TME; ComponentLink5URL: https://datasheet.octopart.com:443/RC0402FR-0726K7L-Yageo-datasheet-10408619.pdf?src-supplier=_legacy+Avnet; ComponentLink5Description: https://datasheet.octopart.com:443/RC0402FR-0726K7L-Yageo-datasheet-10408619.pdf?src-supplier=_legacy+Avnet; ComponentLink6URL: https://datasheet.octopart.com:443/RC0402FR-0726K7L-Yageo-datasheet-164759695.pdf?src-supplier=Future+Electronics; ComponentLink6Description: https://datasheet.octopart.com:443/RC0402FR-0726K7L-Yageo-datasheet-164759695.pdf?src-supplier=Future+Electronics; ComponentLink7URL: https://datasheet.octopart.com:443/RC0402FR-0726K7L-Yageo-datasheet-137700087.pdf?src-supplier=Future+Electronics; ComponentLink7Description: https://datasheet.octopart.com:443/RC0402FR-0726K7L-Yageo-datasheet-137700087.pdf?src-supplier=Future+Electronics; ComponentLink8URL: https://datasheet.octopart.com:443/RC0402FR-0726K7L-Yageo-datasheet-12531192.pdf?src-supplier=Future+Electronics; ComponentLink8Description: https://datasheet.octopart.com:443/RC0402FR-0726K7L-Yageo-datasheet-12531192.pdf?src-supplier=Future+Electronics; ComponentLink9URL: https://datasheet.octopart.com:443/RC0402FR-0726K7L-Yageo-datasheet-8324527.pdf?src-supplier=Future+Electronics; ComponentLink9Description: https://datasheet.octopart.com:443/RC0402FR-0726K7L-Yageo-datasheet-8324527.pdf?src-supplier=Future+Electronics; ComponentLink10URL: https://datasheet.octopart.com/RC0402FR-0726K7L-Yageo-datasheet-73766026.pdf; ComponentLink10Description: https://datasheet.octopart.com/RC0402FR-0726K7L-Yageo-datasheet-73766026.pdf; ComponentLink11URL: http://sigma.octopart.com:80/conflict_mineral_statement/Yageo-company-3.pdf?src-supplier=Compliance+Statements; ComponentLink11Description: http://sigma.octopart.com:80/conflict_mineral_statement/Yageo-company-3.pdf?src-supplier=Compliance+Statements; ComponentLink12URL: http://sigma.octopart.com:80/rohs_statement/Yageo-company-2.pdf?src-supplier=Compliance+Statements; ComponentLink12Description: http://sigma.octopart.com:80/rohs_statement/Yageo-company-2.pdf?src-supplier=Compliance+Statements
R15-R25 R33 R35-R39 = RC0402JR-070RL: GENERAL PURPOSE CHIP RESISTOR Metal Glaze/thick Film, 0.0625W, 0ohm, Surface Mount, 0402; Manufacturer: Yageo Group; Max Power Dissipation: 63mW; Power Dissipation: 62.5mW; Value: 0Ω; Temperature Coefficient: 200ppm/°C; Tolerance: 5%; Voltage Rating: 50V; Supplier: DigiKey; Supplier Part Number: 311-0.0JRCT-ND; Manufacturer Part Number: RC0402JR-070RL; RoHS: Compliant; Category: Chip SMD Resistors; Stock: 15603665; Pricing: 1=0.1, 10=0.010, 25=0.0064, 50=0.0054, 100=0.0047, 250=0.00392, 500=0.00346, 1000=0.00304, 5000=0.0023 (USD); Case/Package: 0402; Case Code (Imperial): 0402; China RoHS: Non-Compliant; Composition: Thick Film; Contact Plating: Tin; Depth: 500µm; Features: Moisture Resistant; Height: 350µm; Lead Free: Lead Free; Length: 1mm; Lifecycle Status: Production; Max Operating Temperature: 155°C; Military Standard: Not; Min Operating Temperature: -55°C; Mounting Technology: Surface Mount; Pins: 2; Number of Terminals: 2; Number of Terminations: 2; Packaging: Tape & Reel; Power Rating: 63mW; Radiation Hardening: No; REACH SVHC: Yes; Schedule B: 8533290000, 8533290000|8533290000, 8533290000|8533290000|8533290000, 8533290000|8533290000|8533290000|8533290000; Termination: SMD/SMT; Voltage Rating (DC): 50V; Width: 500µm; ComponentLink1URL: https://datasheet.octopart.com:443/RC0402JR-070RL-Yageo-datasheet-182189538.pdf?src-supplier=IHS; ComponentLink1Description: https://datasheet.octopart.com:443/RC0402JR-070RL-Yageo-datasheet-182189538.pdf?src-supplier=IHS; ComponentLink2URL: https://datasheet.octopart.com:443/RC0402JR-070RL-Yageo-datasheet-10408619.pdf?src-supplier=Newark; ComponentLink2Description: https://datasheet.octopart.com:443/RC0402JR-070RL-Yageo-datasheet-10408619.pdf?src-supplier=Newark; ComponentLink3URL: https://datasheet.octopart.com:443/RC0402JR-070RL-Yageo-Group-datasheet-181964826.pdf?src-supplier=Newark; ComponentLink3Description: https://datasheet.octopart.com:443/RC0402JR-070RL-Yageo-Group-datasheet-181964826.pdf?src-supplier=Newark; ComponentLink4URL: https://datasheet.octopart.com:443/RC0402JR-070RL-Yageo-datasheet-12531192.pdf?src-supplier=Seeed+Studio; ComponentLink4Description: https://datasheet.octopart.com:443/RC0402JR-070RL-Yageo-datasheet-12531192.pdf?src-supplier=Seeed+Studio; ComponentLink5URL: https://datasheet.octopart.com:443/RC0402JR-070RL-Yageo-datasheet-8324527.pdf?src-supplier=TME; ComponentLink5Description: https://datasheet.octopart.com:443/RC0402JR-070RL-Yageo-datasheet-8324527.pdf?src-supplier=TME; ComponentLink6URL: https://datasheet.octopart.com:443/RC0402JR-070RL-Yageo-datasheet-62067350.pdf?src-supplier=Farnell; ComponentLink6Description: https://datasheet.octopart.com:443/RC0402JR-070RL-Yageo-datasheet-62067350.pdf?src-supplier=Farnell; ComponentLink7URL: https://datasheet.octopart.com:443/RC0402JR-070RL-Yageo-datasheet-8329306.pdf?src-supplier=element14; ComponentLink7Description: https://datasheet.octopart.com:443/RC0402JR-070RL-Yageo-datasheet-8329306.pdf?src-supplier=element14; ComponentLink8URL: https://datasheet.octopart.com:443/RC0402JR-070RL-Yageo-datasheet-505231.pdf?src-supplier=element14; ComponentLink8Description: https://datasheet.octopart.com:443/RC0402JR-070RL-Yageo-datasheet-505231.pdf?src-supplier=element14; ComponentLink9URL: https://datasheet.octopart.com:443/RC0402JR-070RL-Yageo-datasheet-175423674.pdf?src-supplier=SOS+electronic; ComponentLink9Description: https://datasheet.octopart.com:443/RC0402JR-070RL-Yageo-datasheet-175423674.pdf?src-supplier=SOS+electronic; ComponentLink10URL: https://datasheet.octopart.com:443/RC0402JR-070RL-Yageo-datasheet-164759695.pdf?src-supplier=Future+Electronics; ComponentLink10Description: https://datasheet.octopart.com:443/RC0402JR-070RL-Yageo-datasheet-164759695.pdf?src-supplier=Future+Electronics; ComponentLink11URL: https://datasheet.octopart.com:443/RC0402JR-070RL-Yageo-datasheet-137700087.pdf?src-supplier=Future+Electronics; ComponentLink11Description: https://datasheet.octopart.com:443/RC0402JR-070RL-Yageo-datasheet-137700087.pdf?src-supplier=Future+Electronics; ComponentLink12URL: https://datasheet.octopart.com/RC0402JR-070RL-Yageo-datasheet-73766026.pdf; ComponentLink12Description: https://datasheet.octopart.com/RC0402JR-070RL-Yageo-datasheet-73766026.pdf; ComponentLink13URL: http://sigma.octopart.com:80/conflict_mineral_statement/Yageo-company-3.pdf?src-supplier=Compliance+Statements; ComponentLink13Description: http://sigma.octopart.com:80/conflict_mineral_statement/Yageo-company-3.pdf?src-supplier=Compliance+Statements; ComponentLink14URL: http://sigma.octopart.com:80/rohs_statement/Yageo-company-2.pdf?src-supplier=Compliance+Statements; ComponentLink14Description: http://sigma.octopart.com:80/rohs_statement/Yageo-company-2.pdf?src-supplier=Compliance+Statements
R26 R27 R29 = ERJ-2RKF2400X: Res Thick Film 0402 240 Ohm 1% 0.1W ±100ppm/°C Molded SMD Punched Carrier T/R; Manufacturer: Panasonic; Manufacturer Lifecycle Status: ACTIVE; Part Series: Precision Thick Film Chip Resistors; Max Power Dissipation: 100mW; Power Rating: 63mW; Value: 240Ω; Voltage Rating: 50V; Supplier: DigiKey; Supplier Part Number: P240LCT-ND; Manufacturer Part Number: ERJ-2RKF2400X; RoHS: Compliant; Category: Chip SMD Resistors; Stock: 1919536; Pricing: 1=0.1, 10=0.028, 25=0.0208, 50=0.0168, 100=0.0138, 250=0.01072, 500=0.009, 1000=0.00766, 5000=0.00554 (USD); Case/Package: 0402; Case Code (Imperial): 0402; Case Code (Metric): 1005; China RoHS: Non-Compliant; Composition: Thick Film; Contact Plating: Tin; Depth: 500µm; Features: Automotive AEC-Q200; Height: 350µm; Lead Free: Lead Free; Length: 1mm; Lifecycle Status: Production; Max Operating Temperature: 155°C; Military Standard: Not; Min Operating Temperature: -55°C; Mounting Technology: Surface Mount; Pins: 2; Number of Terminals: 2; Number of Terminations: 2; Packaging: Tape and Reel; Power Dissipation: 100mW; Radiation Hardening: No; REACH SVHC: Yes; Schedule B: 8533210045, 8533210045|8533210045|8533210045|8533210045|8533210045|8533210045|8533210045|8533210045|8533210045|8533210045|8533210045|8533210045|8533210045|8533210045|8533210045|8533210045|8533210045|8533210045|8533210045|8533210045|8533210045|8533210045|8533210045|85; Temperature Coefficient: 100ppm/°C; Termination: SMD/SMT; Tolerance: 1%; Voltage Rating (DC): 50V; Width: 500µm; Working Voltage: 50V; ComponentLink1URL: https://datasheet.octopart.com:443/ERJ-2RKF2400X-Panasonic-datasheet-82288794.pdf?src-supplier=Panasonic; ComponentLink1Description: https://datasheet.octopart.com:443/ERJ-2RKF2400X-Panasonic-datasheet-82288794.pdf?src-supplier=Panasonic; ComponentLink2URL: https://datasheet.octopart.com:443/ERJ-2RKF2400X-Panasonic-datasheet-48891056.pdf?src-supplier=Upverter; ComponentLink2Description: https://datasheet.octopart.com:443/ERJ-2RKF2400X-Panasonic-datasheet-48891056.pdf?src-supplier=Upverter; ComponentLink3URL: https://datasheet.octopart.com:443/ERJ-2RKF2400X-Panasonic-datasheet-13266541.pdf?src-supplier=Farnell; ComponentLink3Description: https://datasheet.octopart.com:443/ERJ-2RKF2400X-Panasonic-datasheet-13266541.pdf?src-supplier=Farnell; ComponentLink4URL: https://datasheet.octopart.com:443/ERJ-2RKF2400X-Panasonic-datasheet-10025800.pdf?src-supplier=Farnell; ComponentLink4Description: https://datasheet.octopart.com:443/ERJ-2RKF2400X-Panasonic-datasheet-10025800.pdf?src-supplier=Farnell; ComponentLink5URL: https://datasheet.octopart.com:443/ERJ-2RKF2400X-Panasonic-datasheet-8853621.pdf?src-supplier=Farnell; ComponentLink5Description: https://datasheet.octopart.com:443/ERJ-2RKF2400X-Panasonic-datasheet-8853621.pdf?src-supplier=Farnell; ComponentLink6URL: https://datasheet.octopart.com:443/ERJ-2RKF2400X-Panasonic-datasheet-136608610.pdf?src-supplier=Farnell; ComponentLink6Description: https://datasheet.octopart.com:443/ERJ-2RKF2400X-Panasonic-datasheet-136608610.pdf?src-supplier=Farnell; ComponentLink7URL: https://datasheet.octopart.com:443/ERJ2RKF2400X-Panasonic---ECG-datasheet-15994758.pdf?src-supplier=Farnell; ComponentLink7Description: https://datasheet.octopart.com:443/ERJ2RKF2400X-Panasonic---ECG-datasheet-15994758.pdf?src-supplier=Farnell; ComponentLink8URL: https://datasheet.octopart.com:443/ERJ-2RKF2400X-Panasonic-datasheet-5313456.pdf?src-supplier=Newark; ComponentLink8Description: https://datasheet.octopart.com:443/ERJ-2RKF2400X-Panasonic-datasheet-5313456.pdf?src-supplier=Newark; ComponentLink9URL: https://datasheet.octopart.com:443/ERJ-2RKF2400X-Panasonic-datasheet-154766169.pdf?src-supplier=Master+Electronics; ComponentLink9Description: https://datasheet.octopart.com:443/ERJ-2RKF2400X-Panasonic-datasheet-154766169.pdf?src-supplier=Master+Electronics; ComponentLink10URL: https://datasheet.octopart.com:443/ERJ2RKF2400X-Panasonic-datasheet-188592431.pdf?src-supplier=TME; ComponentLink10Description: https://datasheet.octopart.com:443/ERJ2RKF2400X-Panasonic-datasheet-188592431.pdf?src-supplier=TME; ComponentLink11URL: https://datasheet.octopart.com:443/ERJ2RKF2400X-Panasonic-datasheet-164353789.pdf?src-supplier=TME; ComponentLink11Description: https://datasheet.octopart.com:443/ERJ2RKF2400X-Panasonic-datasheet-164353789.pdf?src-supplier=TME; ComponentLink12URL: https://datasheet.octopart.com/ERJ-2RKF2400X-Panasonic-datasheet-78375410.pdf; ComponentLink12Description: https://datasheet.octopart.com/ERJ-2RKF2400X-Panasonic-datasheet-78375410.pdf; ComponentLink13URL: https://datasheet.octopart.com:443/ERJ-2RKF2400X-Panasonic-datasheet-41391857.pdf?src-supplier=Electro+Sonic; ComponentLink13Description: https://datasheet.octopart.com:443/ERJ-2RKF2400X-Panasonic-datasheet-41391857.pdf?src-supplier=Electro+Sonic
R28 = ERA-2ARB751X: Res Thin Film 0402 750 Ohm 0.1% 0.063W(1/16W) ±10ppm/C Pad SMD Automotive T/R; Manufacturer: Panasonic; Manufacturer Lifecycle Status: ACTIVE; Part Series: Thin Film Chip Resistors, High Reliability Type; Max Power Dissipation: 63mW; Value: 750Ω; Temperature Coefficient: 10ppm/°C; Voltage Rating: 50V; Supplier: DigiKey; Supplier Part Number: 10-ERA-2ARB751XDKR-ND; Manufacturer Part Number: ERA-2ARB751X; RoHS: Compliant; Category: Chip SMD Resistors; Stock: 11665; Pricing: 1=0.46, 10=0.386, 25=0.358, 50=0.3382, 100=0.3198, 250=0.29784, 500=0.28296, 1000=0.26954, 5000=0.25765 (USD); Case/Package: 0402; Case Code (Imperial): 0402; Case Code (Metric): 1005; Composition: Thin Film; Features: Automotive AEC-Q200; Height: 350µm; Lead Free: Lead Free; Length: 990.6µm; Lifecycle Status: Production; Max Operating Temperature: 155°C; Min Operating Temperature: -55°C; Mounting Technology: Surface Mount; Number of Terminals: 2; Number of Terminations: 2; Packaging: Cut Tape; Power Dissipation: 63mW; Power Rating: 63mW; REACH SVHC: Yes; Tolerance: 0.1%; Voltage Rating (DC): 50V; Width: 500µm; Working Voltage: 50V; ComponentLink1URL: https://datasheet.octopart.com:443/ERA-2ARB751X-Panasonic-datasheet-62287448.pdf?src-supplier=Panasonic; ComponentLink1Description: https://datasheet.octopart.com:443/ERA-2ARB751X-Panasonic-datasheet-62287448.pdf?src-supplier=Panasonic; ComponentLink2URL: https://datasheet.octopart.com:443/ERA-2ARB751X-Panasonic-datasheet-46744048.pdf?src-supplier=Newark; ComponentLink2Description: https://datasheet.octopart.com:443/ERA-2ARB751X-Panasonic-datasheet-46744048.pdf?src-supplier=Newark; ComponentLink3URL: https://datasheet.octopart.com:443/ERA2ARB751X-Panasonic-datasheet-136531316.pdf?src-supplier=element14+APAC; ComponentLink3Description: https://datasheet.octopart.com:443/ERA2ARB751X-Panasonic-datasheet-136531316.pdf?src-supplier=element14+APAC; ComponentLink4URL: https://sigma.octopart.com:443/150570796/technical_drawing/Panasonic-ERA2ARB751X.pdf?src-supplier=Panasonic+SCT; ComponentLink4Description: https://sigma.octopart.com:443/150570796/technical_drawing/Panasonic-ERA2ARB751X.pdf?src-supplier=Panasonic+SCT; ComponentLink5URL: https://datasheet.octopart.com/ERA-2ARB751X-Panasonic-datasheet-78375410.pdf; ComponentLink5Description: https://datasheet.octopart.com/ERA-2ARB751X-Panasonic-datasheet-78375410.pdf
R40 = RC0402FR-07470KL: 62.5mW Thick Film Resistors 50V ±100ppm/℃ ±1% 470kΩ 0402 Chip Resistor - Surface Mount ROHS; Manufacturer: Yageo Group; Max Power Dissipation: 63mW; Temperature Coefficient: 100ppm/°C; Supplier: DigiKey; Supplier Part Number: 311-470KLRCT-ND; Manufacturer Part Number: RC0402FR-07470KL; RoHS: Compliant; Category: Chip SMD Resistors; Stock: 557194; Pricing: 1=0.1, 10=0.007, 25=0.0056, 50=0.004, 100=0.0033 (USD); Case/Package: 0402; Case Code (Imperial): 0402; China RoHS: Non-Compliant; Composition: Thick Film; Depth: 500µm; Features: Moisture Resistant; Height: 350µm; Lead Free: Lead Free; Length: 1mm; Lifecycle Status: Production; Max Operating Temperature: 155°C; Military Standard: Not; Min Operating Temperature: -55°C; Mounting Technology: Surface Mount; Pins: 2; Number of Terminals: 2; Number of Terminations: 2; Packaging: Tape & Reel; Power Dissipation: 62.5mW; Power Rating: 63mW; REACH SVHC: Yes; Value: 470kΩ; Schedule B: 8533210045, 8533210045|8533210045, 8533210045|8533210045|8533210045, 8533210045|8533210045|8533210045|8533210045; Termination: SMD/SMT; Tolerance: 1%; Voltage Rating: 50V; Voltage Rating (AC): 50V; Voltage Rating (DC): 50V; Width: 500µm; Working Voltage: 50V; ComponentLink1URL: https://datasheet.octopart.com:443/RC0402FR-07470KL-Yageo-datasheet-175887523.pdf?src-supplier=IHS; ComponentLink1Description: https://datasheet.octopart.com:443/RC0402FR-07470KL-Yageo-datasheet-175887523.pdf?src-supplier=IHS; ComponentLink2URL: https://datasheet.octopart.com:443/RC0402FR-07470KL-Yageo-datasheet-103092701.pdf?src-supplier=Upverter; ComponentLink2Description: https://datasheet.octopart.com:443/RC0402FR-07470KL-Yageo-datasheet-103092701.pdf?src-supplier=Upverter; ComponentLink3URL: https://datasheet.octopart.com:443/RC0402FR-07470KL-Yageo-datasheet-141435361.pdf?src-supplier=Upverter; ComponentLink3Description: https://datasheet.octopart.com:443/RC0402FR-07470KL-Yageo-datasheet-141435361.pdf?src-supplier=Upverter; ComponentLink4URL: https://datasheet.octopart.com:443/RC0402FR-07470KL-Yageo-Group-datasheet-190305687.pdf?src-supplier=Newark; ComponentLink4Description: https://datasheet.octopart.com:443/RC0402FR-07470KL-Yageo-Group-datasheet-190305687.pdf?src-supplier=Newark; ComponentLink5URL: https://datasheet.octopart.com:443/RC0402FR-07470KL-Yageo-datasheet-8324527.pdf?src-supplier=Newark; ComponentLink5Description: https://datasheet.octopart.com:443/RC0402FR-07470KL-Yageo-datasheet-8324527.pdf?src-supplier=Newark; ComponentLink6URL: https://datasheet.octopart.com:443/RC0402FR-07470KL-Yageo-datasheet-10408619.pdf?src-supplier=element14+APAC; ComponentLink6Description: https://datasheet.octopart.com:443/RC0402FR-07470KL-Yageo-datasheet-10408619.pdf?src-supplier=element14+APAC; ComponentLink7URL: https://datasheet.octopart.com:443/RC0402FR-07470KL-Yageo-datasheet-62067350.pdf?src-supplier=element14+APAC; ComponentLink7Description: https://datasheet.octopart.com:443/RC0402FR-07470KL-Yageo-datasheet-62067350.pdf?src-supplier=element14+APAC; ComponentLink8URL: https://datasheet.octopart.com:443/RC0402FR-07470KL-Yageo-Group-datasheet-176638170.pdf?src-supplier=Future+Electronics; ComponentLink8Description: https://datasheet.octopart.com:443/RC0402FR-07470KL-Yageo-Group-datasheet-176638170.pdf?src-supplier=Future+Electronics; ComponentLink9URL: https://datasheet.octopart.com:443/RC0402FR-07470KL-Yageo-datasheet-164759695.pdf?src-supplier=Future+Electronics; ComponentLink9Description: https://datasheet.octopart.com:443/RC0402FR-07470KL-Yageo-datasheet-164759695.pdf?src-supplier=Future+Electronics; ComponentLink10URL: https://datasheet.octopart.com:443/RC0402FR-07470KL-Yageo-datasheet-137700087.pdf?src-supplier=Future+Electronics; ComponentLink10Description: https://datasheet.octopart.com:443/RC0402FR-07470KL-Yageo-datasheet-137700087.pdf?src-supplier=Future+Electronics; ComponentLink11URL: https://datasheet.octopart.com:443/RC0402FR-07470KL-Yageo-datasheet-12531192.pdf?src-supplier=Future+Electronics; ComponentLink11Description: https://datasheet.octopart.com:443/RC0402FR-07470KL-Yageo-datasheet-12531192.pdf?src-supplier=Future+Electronics; ComponentLink12URL: https://datasheet.octopart.com:443/RC0402FR-07470KL-Yageo-datasheet-505231.pdf?src-supplier=Future+Electronics; ComponentLink12Description: https://datasheet.octopart.com:443/RC0402FR-07470KL-Yageo-datasheet-505231.pdf?src-supplier=Future+Electronics; ComponentLink13URL: https://datasheet.octopart.com:443/RC0402FR-07470KL-Yageo-datasheet-148775077.pdf?src-supplier=TME; ComponentLink13Description: https://datasheet.octopart.com:443/RC0402FR-07470KL-Yageo-datasheet-148775077.pdf?src-supplier=TME; ComponentLink14URL: https://datasheet.octopart.com/RC0402FR-07470KL-Yageo-datasheet-73766026.pdf; ComponentLink14Description: https://datasheet.octopart.com/RC0402FR-07470KL-Yageo-datasheet-73766026.pdf; ComponentLink15URL: https://datasheet.octopart.com:443/RC0402FR-07470KL-Yageo-datasheet-8329306.pdf?src-supplier=element14; ComponentLink15Description: https://datasheet.octopart.com:443/RC0402FR-07470KL-Yageo-datasheet-8329306.pdf?src-supplier=element14; ComponentLink16URL: http://sigma.octopart.com:80/conflict_mineral_statement/Yageo-company-3.pdf?src-supplier=Compliance+Statements; ComponentLink16Description: http://sigma.octopart.com:80/conflict_mineral_statement/Yageo-company-3.pdf?src-supplier=Compliance+Statements; ComponentLink17URL: http://sigma.octopart.com:80/rohs_statement/Yageo-company-2.pdf?src-supplier=Compliance+Statements; ComponentLink17Description: http://sigma.octopart.com:80/rohs_statement/Yageo-company-2.pdf?src-supplier=Compliance+Statements
T1 T2 T15 = Testpoint: Holes to test various points in the shcematic